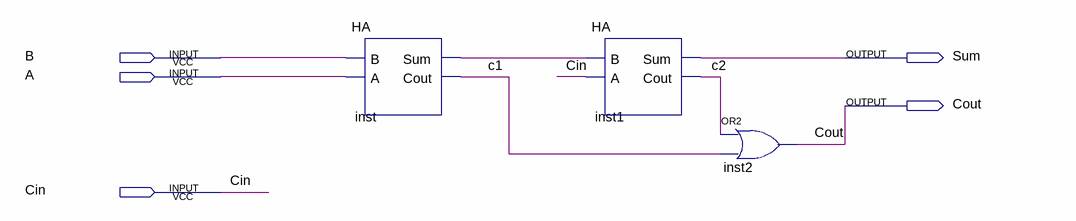
[diagram p0: schematic sheet]
// Quartus schematic FA.bdf as structural Verilog: 3 symbols, 5 pins
module FA (
  input  B,
  input  A,
  input  Cin,
  output Sum,
  output Cout
);

  wire c1, c2, inst_sum;

  HA inst (.B(B), .A(A), .Sum(inst_sum), .Cout(c1));
  HA inst1 (.B(inst_sum), .A(Cin), .Sum(Sum), .Cout(c2));
  or inst2 (Cout, c2, c1);
endmodule
